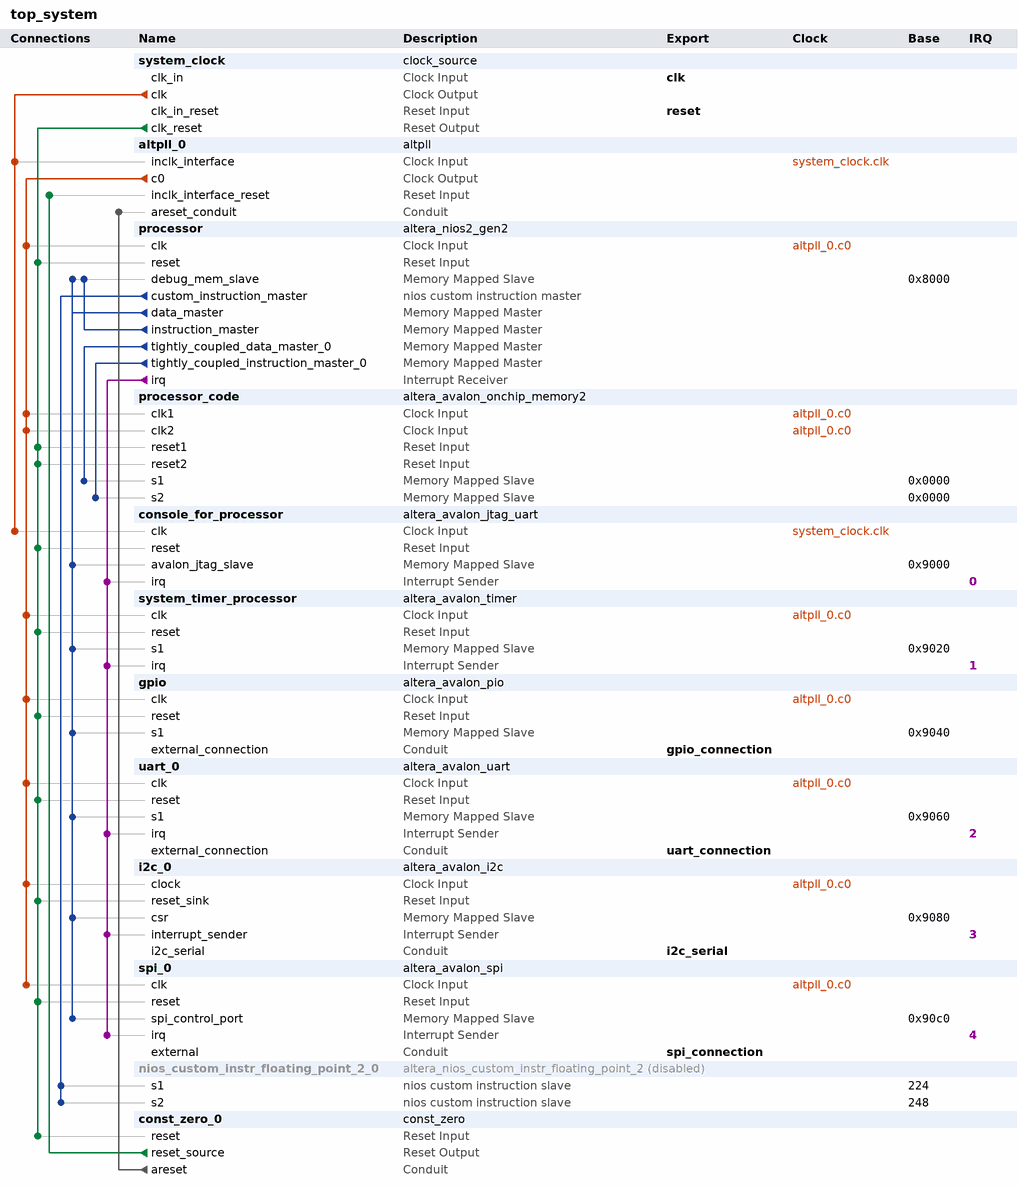
[diagram p0: system contents]
# Platform Designer (Qsys) system top_system, MAX 10 10M08DAF256C8GES
# Parameters at their usual value, and those the tool derives, are not listed.
package require -exact qsys 23.1
create_system top_system
set_project_property DEVICE_FAMILY {MAX 10}
set_project_property DEVICE 10M08DAF256C8GES

add_instance system_clock clock_source 23.1
set_instance_parameter_value system_clock clockFrequency 10000000

add_instance altpll_0 altpll 23.1
set_instance_parameter_value altpll_0 CLK0_DIVIDE_BY 1
set_instance_parameter_value altpll_0 CLK0_MULTIPLY_BY 10
set_instance_parameter_value altpll_0 INCLK0_INPUT_FREQUENCY 100000
set_instance_parameter_value altpll_0 PORT_ARESET PORT_USED
set_instance_parameter_value altpll_0 PORT_LOCKED PORT_USED
set_instance_parameter_value altpll_0 PORT_clk1 PORT_UNUSED
set_instance_parameter_value altpll_0 PORT_clk2 PORT_UNUSED
set_instance_parameter_value altpll_0 PORT_clk3 PORT_UNUSED

add_instance processor altera_nios2_gen2 23.1
set_instance_parameter_value processor dcache_numTCDM 1
set_instance_parameter_value processor dcache_size 0
set_instance_parameter_value processor exceptionSlave processor_code.s2
set_instance_parameter_value processor icache_numTCIM 1
set_instance_parameter_value processor icache_size 2048
set_instance_parameter_value processor impl Fast
set_instance_parameter_value processor mul_32_impl 0
set_instance_parameter_value processor mul_shift_choice 1
set_instance_parameter_value processor resetSlave processor_code.s2
set_instance_parameter_value processor resetrequest_enabled false
set_instance_parameter_value processor setting_branchpredictiontype Static

add_instance processor_code altera_avalon_onchip_memory2 23.1
set_instance_parameter_value processor_code blockType M9K
set_instance_parameter_value processor_code dataWidth 32
set_instance_parameter_value processor_code dualPort true
set_instance_parameter_value processor_code initMemContent true
set_instance_parameter_value processor_code initializationFileName C:/Users/mdubicki/nokia/maximator/maxduino/software/maxduino_hello/mem_init/processor0_code.hex
set_instance_parameter_value processor_code memorySize 32768

add_instance console_for_processor altera_avalon_jtag_uart 23.1
set_instance_parameter_value console_for_processor simInteractiveOptions NO_INTERACTIVE_WINDOWS

add_instance system_timer_processor altera_avalon_timer 23.1
set_instance_parameter_value system_timer_processor alwaysRun true
set_instance_parameter_value system_timer_processor fixedPeriod true
set_instance_parameter_value system_timer_processor period 10
set_instance_parameter_value system_timer_processor periodUnits MSEC
set_instance_parameter_value system_timer_processor snapshot false

add_instance gpio altera_avalon_pio 23.1
set_instance_parameter_value gpio bitModifyingOutReg true
set_instance_parameter_value gpio direction Bidir
set_instance_parameter_value gpio width 20

add_instance uart_0 altera_avalon_uart 23.1
set_instance_parameter_value uart_0 baud 115200
set_instance_parameter_value uart_0 dataBits 8
set_instance_parameter_value uart_0 fixedBaud true
set_instance_parameter_value uart_0 parity NONE
set_instance_parameter_value uart_0 stopBits 1

add_instance i2c_0 altera_avalon_i2c 23.1
set_instance_parameter_value i2c_0 FIFO_DEPTH 4

add_instance spi_0 altera_avalon_spi 23.1
set_instance_parameter_value spi_0 clockPolarity 0
set_instance_parameter_value spi_0 dataWidth 8
set_instance_parameter_value spi_0 masterSPI true
set_instance_parameter_value spi_0 numberOfSlaves 1
set_instance_parameter_value spi_0 targetClockRate 128000

add_instance nios_custom_instr_floating_point_2_0 altera_nios_custom_instr_floating_point_2 23.1
set_instance_property nios_custom_instr_floating_point_2_0 ENABLED false
set_instance_parameter_value nios_custom_instr_floating_point_2_0 arithmetic_present true
set_instance_parameter_value nios_custom_instr_floating_point_2_0 comparison_present true
set_instance_parameter_value nios_custom_instr_floating_point_2_0 conversion_present true
set_instance_parameter_value nios_custom_instr_floating_point_2_0 root_present true

add_instance const_zero_0 const_zero 1.0

# connections
add_connection altpll_0.c0 gpio.clk clock
add_connection altpll_0.c0 i2c_0.clock clock
add_connection altpll_0.c0 processor.clk clock
add_connection altpll_0.c0 processor_code.clk1 clock
add_connection altpll_0.c0 processor_code.clk2 clock
add_connection altpll_0.c0 spi_0.clk clock
add_connection altpll_0.c0 system_timer_processor.clk clock
add_connection altpll_0.c0 uart_0.clk clock
add_connection system_clock.clk altpll_0.inclk_interface clock
add_connection system_clock.clk console_for_processor.clk clock
add_connection const_zero_0.reset_source altpll_0.inclk_interface_reset reset
add_connection system_clock.clk_reset console_for_processor.reset reset
add_connection system_clock.clk_reset const_zero_0.reset reset
add_connection system_clock.clk_reset gpio.reset reset
add_connection system_clock.clk_reset i2c_0.reset_sink reset
add_connection system_clock.clk_reset processor.reset reset
add_connection system_clock.clk_reset processor_code.reset1 reset
add_connection system_clock.clk_reset processor_code.reset2 reset
add_connection system_clock.clk_reset spi_0.reset reset
add_connection system_clock.clk_reset system_timer_processor.reset reset
add_connection system_clock.clk_reset uart_0.reset reset
add_connection processor.data_master console_for_processor.avalon_jtag_slave avalon
set_connection_parameter_value processor.data_master/console_for_processor.avalon_jtag_slave baseAddress 0x9000
add_connection processor.data_master gpio.s1 avalon
set_connection_parameter_value processor.data_master/gpio.s1 baseAddress 0x9040
add_connection processor.data_master i2c_0.csr avalon
set_connection_parameter_value processor.data_master/i2c_0.csr baseAddress 0x9080
add_connection processor.data_master processor.debug_mem_slave avalon
set_connection_parameter_value processor.data_master/processor.debug_mem_slave baseAddress 0x8000
add_connection processor.data_master spi_0.spi_control_port avalon
set_connection_parameter_value processor.data_master/spi_0.spi_control_port baseAddress 0x90c0
add_connection processor.data_master system_timer_processor.s1 avalon
set_connection_parameter_value processor.data_master/system_timer_processor.s1 baseAddress 0x9020
add_connection processor.data_master uart_0.s1 avalon
set_connection_parameter_value processor.data_master/uart_0.s1 baseAddress 0x9060
add_connection processor.instruction_master processor.debug_mem_slave avalon
set_connection_parameter_value processor.instruction_master/processor.debug_mem_slave baseAddress 0x8000
add_connection processor.tightly_coupled_data_master_0 processor_code.s1 avalon
set_connection_parameter_value processor.tightly_coupled_data_master_0/processor_code.s1 baseAddress 0x0000
add_connection processor.tightly_coupled_instruction_master_0 processor_code.s2 avalon
set_connection_parameter_value processor.tightly_coupled_instruction_master_0/processor_code.s2 baseAddress 0x0000
add_connection const_zero_0.areset altpll_0.areset_conduit conduit
add_connection processor.irq console_for_processor.irq interrupt
set_connection_parameter_value processor.irq/console_for_processor.irq irqNumber 0
add_connection processor.irq i2c_0.interrupt_sender interrupt
set_connection_parameter_value processor.irq/i2c_0.interrupt_sender irqNumber 3
add_connection processor.irq spi_0.irq interrupt
set_connection_parameter_value processor.irq/spi_0.irq irqNumber 4
add_connection processor.irq system_timer_processor.irq interrupt
set_connection_parameter_value processor.irq/system_timer_processor.irq irqNumber 1
add_connection processor.irq uart_0.irq interrupt
set_connection_parameter_value processor.irq/uart_0.irq irqNumber 2
add_connection processor.custom_instruction_master nios_custom_instr_floating_point_2_0.s1 nios_custom_instruction
set_connection_parameter_value processor.custom_instruction_master/nios_custom_instr_floating_point_2_0.s1 CIName nios_custom_instr_floating_point_2_0
set_connection_parameter_value processor.custom_instruction_master/nios_custom_instr_floating_point_2_0.s1 baseAddress 224
add_connection processor.custom_instruction_master nios_custom_instr_floating_point_2_0.s2 nios_custom_instruction
set_connection_parameter_value processor.custom_instruction_master/nios_custom_instr_floating_point_2_0.s2 CIName nios_custom_instr_floating_point_2_0_1
set_connection_parameter_value processor.custom_instruction_master/nios_custom_instr_floating_point_2_0.s2 baseAddress 248

# exported interfaces
add_interface clk clock sink
set_interface_property clk EXPORT_OF system_clock.clk_in
add_interface gpio_connection conduit end
set_interface_property gpio_connection EXPORT_OF gpio.external_connection
add_interface i2c_serial conduit end
set_interface_property i2c_serial EXPORT_OF i2c_0.i2c_serial
add_interface reset reset sink
set_interface_property reset EXPORT_OF system_clock.clk_in_reset
add_interface spi_connection conduit end
set_interface_property spi_connection EXPORT_OF spi_0.external
add_interface uart_connection conduit end
set_interface_property uart_connection EXPORT_OF uart_0.external_connection

set_interconnect_requirement {$system} qsys_mm.clockCrossingAdapter HANDSHAKE
set_interconnect_requirement {$system} qsys_mm.enableEccProtection FALSE
set_interconnect_requirement {$system} qsys_mm.insertDefaultSlave FALSE
set_interconnect_requirement {$system} qsys_mm.maxAdditionalLatency 1

save_system top_system.qsys
